# EAGLE schematic arpie_main (EAGLE 5.10)
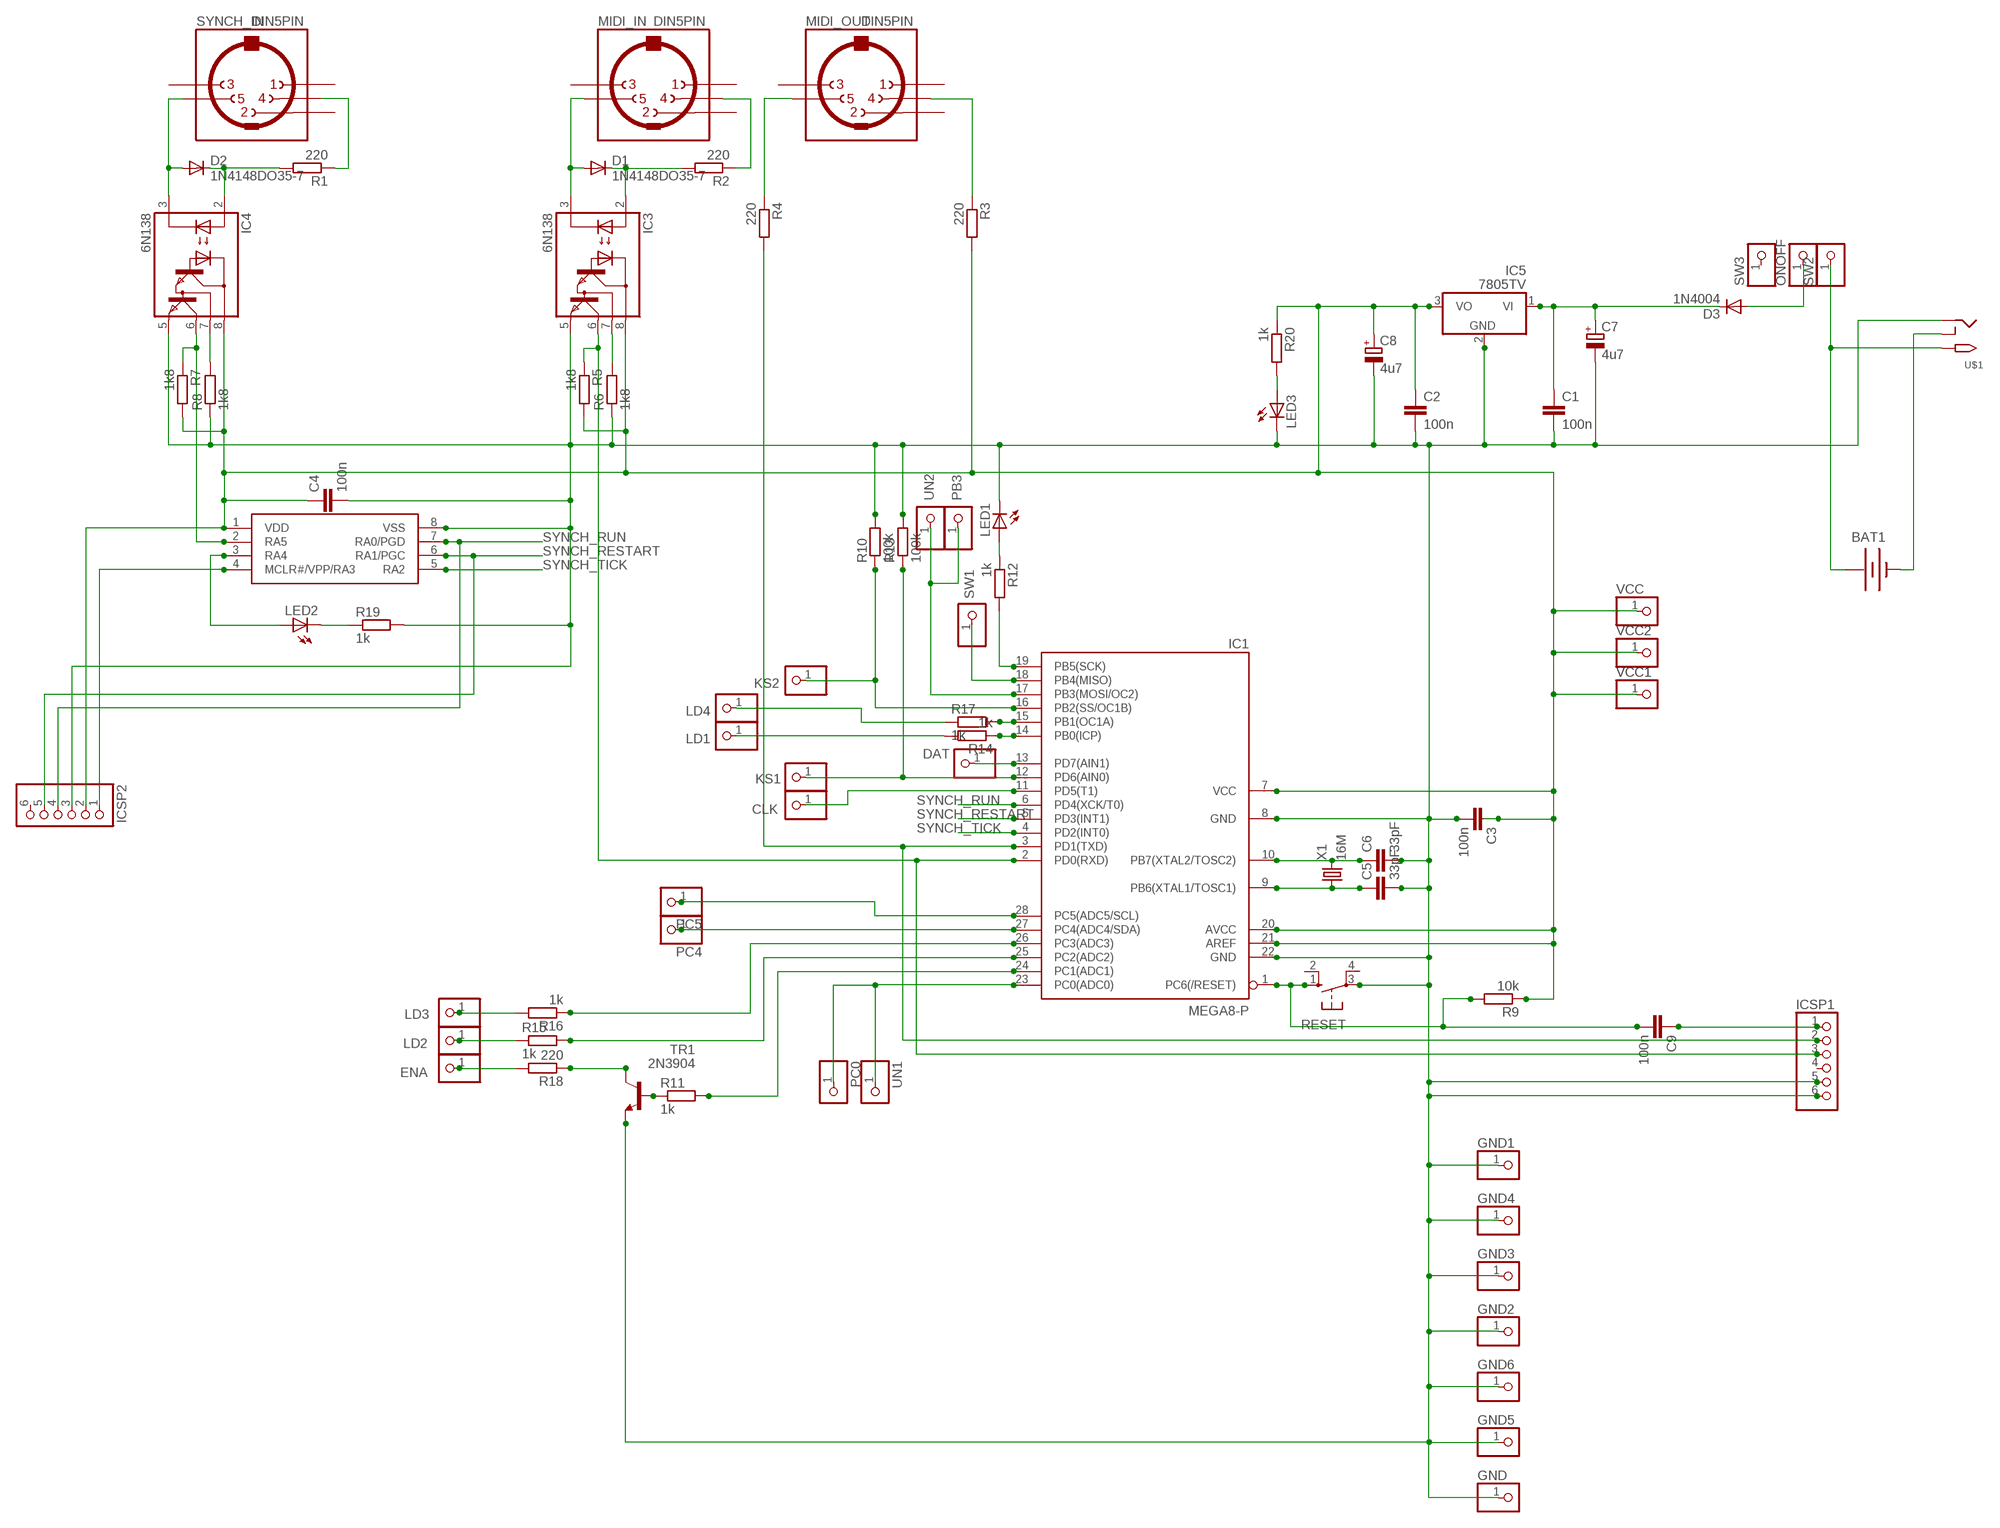
[diagram p0: schematic, sheet 1]

## Parts
BAT1  BATTERY  [PP3_BATTERBOX]
C1  100n  C-EU025-024X044  [C025-024X044]
C2  100n  C-EU025-024X044  [C025-024X044]
C3  100n  C-EU025-024X044  [C025-024X044]
C4  100n  C-EU025-024X044  [C025-024X044]
C5  33pF  C-EU025-024X044  [C025-024X044]
C6  33pF  C-EU025-024X044  [C025-024X044]
C7  4u7  CPOL-EUE2.5-7  [E2,5-7]
C8  4u7  CPOL-EUE2.5-7  [E2,5-7]
C9  100n  C-EU025-024X044  [C025-024X044]
CLK  PINHD-1X1  [1X01]
D1  1N4148DO35-7  [DO35-7]
D2  1N4148DO35-7  [DO35-7]
D3  1N4004  [DO41-10]
DAT  PINHD-1X1  [1X01]
ENA  PINHD-1X1  [1X01]
GND  PINHD-1X1  [1X01]
GND1  PINHD-1X1  [1X01]
GND2  PINHD-1X1  [1X01]
GND3  PINHD-1X1  [1X01]
GND4  PINHD-1X1  [1X01]
GND5  PINHD-1X1  [1X01]
GND6  PINHD-1X1  [1X01]
IC1  MEGA8-P  [DIL28-3]
IC2  PIC12F1822  [DIL08]
IC3  6N138  [DIL08]
IC4  6N138  [DIL08]
IC5  7805TV  [TO220V]
ICSP1  PINHD-1X6  [1X06]
ICSP2  PINHD-1X6  [1X06]
KS1  PINHD-1X1  [1X01]
KS2  PINHD-1X1  [1X01]
LD1  PINHD-1X1  [1X01]
LD2  PINHD-1X1  [1X01]
LD3  PINHD-1X1  [1X01]
LD4  PINHD-1X1  [1X01]
LED1  LED3MM  [LED3MM]
LED2  LED3MM  [LED3MM]
LED3  LED3MM  [LED3MM]
MIDI_IN  DIN5PIN  DIN5PINRAPIDDIN5  [RAPIDDIN5]
MIDI_OUT  DIN5PIN  DIN5PINRAPIDDIN5  [RAPIDDIN5]
ONOFF  PINHD-1X1  [1X01]
PB3  PINHD-1X1  [1X01]
PC0  PINHD-1X1  [1X01]
PC4  PINHD-1X1  [1X01]
PC5  PINHD-1X1  [1X01]
R1  220  R-EU_0207/7  [0207/7]
R2  220  R-EU_0207/7  [0207/7]
R3  220  R-EU_0207/7  [0207/7]
R4  220  R-EU_0207/7  [0207/7]
R5  1k8  R-EU_0207/7  [0207/7]
R6  1k8  R-EU_0207/7  [0207/7]
R7  1k8  R-EU_0207/7  [0207/7]
R8  1k8  R-EU_0207/7  [0207/7]
R9  10k  R-EU_0207/7  [0207/7]
R10  100k  R-EU_0207/7  [0207/7]
R11  1k  R-EU_0207/7  [0207/7]
R12  1k  R-EU_0207/7  [0207/7]
R13  100k  R-EU_0207/2V  [0207/2V]
R14  1k  R-EU_0207/2V  [0207/2V]
R15  1k  R-EU_0207/2V  [0207/2V]
R16  1k  R-EU_0207/2V  [0207/2V]
R17  1k  R-EU_0207/2V  [0207/2V]
R18  220  R-EU_0207/2V  [0207/2V]
R19  1k  R-EU_0207/7  [0207/7]
R20  1k  R-EU_0207/7  [0207/7]
RESET  10-XX  [B3F-10XX]
SW1  PINHD-1X1  [1X01]
SW2  PINHD-1X1  [1X01]
SW3  PINHD-1X1  [1X01]
SYNCH_IN  DIN5PIN  DIN5PINRAPIDDIN5  [RAPIDDIN5]
TR1  2N3904  [TO92]
U$1  2.1MMJACKTHM  [PJ-102A]
UN1  PINHD-1X1  [1X01]
UN2  PINHD-1X1  [1X01]
VCC  PINHD-1X1  [1X01]
VCC1  PINHD-1X1  [1X01]
VCC2  PINHD-1X1  [1X01]
X1  16M  CRYSTALHC49S  [HC49/S]

## Nets
CLK: CLK.1 IC1.11(PD5(T1))
DAT: DAT.1 IC1.13(PD7(AIN1))
ENA: ENA.1 R18.2
GND: C1.2 C2.2 C3.2 C4.2 C5.2 C6.2 C7.- C8.- GND1.1 GND2.1 GND3.1 GND4.1 GND5.1 GND6.1 GND.1 IC1.8(GND) IC1.22(GND) IC2.8(VSS) IC3.5(GND) IC4.5(GND) IC5.2(GND) ICSP1.5 ICSP1.6 ICSP2.3 LED1.K(C) LED3.K(C) R6.1 R8.1 R10.2 R13.2 R19.2 RESET.3(P) TR1.3(E) U$1.RING
KS1: IC1.12(PD6(AIN0)) KS1.1 R13.1
KS2: IC1.16(PB2(SS/OC1B)) KS2.1 R10.1
LD1: LD1.1 R14.2
LD2: LD2.1 R15.1
LD3: LD3.1 R16.2
LD4: LD4.1 R17.1
N$1: D1.A IC3.3(C) MIDI_IN.5
N$2: D1.C IC3.2(A) R2.2
N$3: MIDI_IN.4 R2.1
N$4: D2.A IC4.3(C) SYNCH_IN.5
N$5: D2.C IC4.2(A) R1.2
N$6: R1.1 SYNCH_IN.4
N$7: IC1.2(PD0(RXD)) IC3.6(VO) ICSP1.3 R5.1
N$8: IC3.7(VB) R6.2
N$9: C9.1 ICSP1.1
N$10: IC4.7(VB) R8.2
N$11: MIDI_OUT.5 R4.1
N$12: IC1.3(PD1(TXD)) ICSP1.2 R4.2
N$13: MIDI_OUT.4 R3.1
N$14: R18.1 TR1.1(C)
N$15: IC2.2(RA5) IC4.6(VO) R7.1
N$16: IC2.3(RA4) LED2.A
N$17: IC1.28(PC5(ADC5/SCL)) PC5.1
N$18: IC2.4(MCLR#/VPP/RA3) ICSP2.1
N$19: LED3.A R20.2
N$20: IC1.27(PC4(ADC4/SDA)) PC4.1
N$33: R11.1 TR1.2(B)
N$35: IC1.26(PC3(ADC3)) R16.1
N$36: C6.1 IC1.10(PB7(XTAL2/TOSC2)) X1.2
N$37: C5.1 IC1.9(PB6(XTAL1/TOSC1)) X1.1
N$38: C9.2 IC1.1(PC6(/RESET)) R9.2 RESET.1(S)
N$42: IC1.25(PC2(ADC2)) R15.2
N$43: IC1.24(PC1(ADC1)) R11.2
N$44: IC1.14(PB0(ICP)) R14.1
N$48: IC1.19(PB5(SCK)) R12.2
N$50: LED1.A R12.1
N$52: LED2.K(C) R19.1
N$54: D3.A ONOFF.1
N$55: IC1.15(PB1(OC1A)) R17.2
N$56: BAT1.0V(-) U$1.RING_SW
PWR+: BAT1.9V(+) SW2.1 U$1.TIP
SW1: IC1.18(PB4(MISO)) SW1.1
SYNCH_RESTART: IC1.5(PD3(INT1)) IC2.6(RA1/PGC) ICSP2.5
SYNCH_RUN: IC1.6(PD4(XCK/T0)) IC2.7(RA0/PGD) ICSP2.4
SYNCH_TICK: IC1.4(PD2(INT0)) IC2.5(RA2)
UN1: IC1.23(PC0(ADC0)) PC0.1 UN1.1
UN2: IC1.17(PB3(MOSI/OC2)) PB3.1 UN2.1
VCC: C2.1 C3.1 C4.1 C8.+ IC1.7(VCC) IC1.20(AVCC) IC1.21(AREF) IC2.1(VDD) IC3.8(VCC) IC4.8(VCC) IC5.3(VO) ICSP2.2 R3.2 R5.2 R7.2 R9.1 R20.1 VCC1.1 VCC2.1 VCC.1
VIN: C1.1 C7.+ D3.C IC5.1(VI)
Unconnected: ICSP1.4 ICSP2.6 MIDI_IN.1 MIDI_IN.2 MIDI_IN.3 MIDI_OUT.1 MIDI_OUT.2 MIDI_OUT.3 RESET.2(S1) RESET.4(P1) SW3.1 SYNCH_IN.1 SYNCH_IN.2 SYNCH_IN.3

## Library data of the parts
BAT1 = jasons_stuff:BATTERY: Battery Holders Various common sizes : AA, AAA, 20mm coin cell and 12mm coin cell.
C1-C6 C9 = rcl:C-EU: CAPACITOR, European symbol
C7 C8 = rcl:CPOL-EU: POLARIZED CAPACITOR, European symbol
CLK DAT ENA GND GND1-GND6 KS1 KS2 LD1-LD4 ONOFF PB3 PC0 PC4 PC5 SW1-SW3 UN1 UN2 VCC VCC1 VCC2 = adafruit:PINHD-1X1: Pin header 1x1 for 0.1" spacing With round pins
D1 D2 = diode:1N4148: DIODE high speed (Philips)
D3 = adafruit:1N4004: DIODE General purpose 1N400x type rectifier (With bigger pads) http://www.ladyada.net/library/pcb/eaglelibrary.html
IC1 = atmel:MEGA8-P: MICROCONTROLLER 8 Kbytes FLASH, 1 kbytes SRAM, 512 bytes EEPROM, USART, 4-channel 10 bit ADC, 2-channel 8 bit ADC Pin compatible with Atmega48, ATMega88, ATMega168 Source: avr.lbr
IC2 = jasons_stuff:PIC12F1822
IC3 IC4 = optocoupler:6N138: MOTOROLA OPTO COUPLER
IC5 = linear:78*: Positive VOLTAGE REGULATOR Source: http://cache.national.com/ds/LM/LM78L05.pdf http://www.fairchildsemi.com/ds/LM/LM7805.pdf
ICSP1 ICSP2 = adafruit:PINHD-1X6: PIN HEADER
LED1-LED3 = adafruit:LED: LED OSRAM: - CHIPLED LG R971, LG N971, LY N971, LG Q971, LY Q971, LO R971, LY R971 LH N974, LH R974 LS Q976, LO Q976, LY Q976 LO Q996 - Hyper CHIPLED LW Q18S LB Q993, LB Q99A, LB R99A - SideLED LS A670, LO A670, LY A670, LG A670, LP A670 LB A673, LV A673, LT A673, LW A673 LH A674 LY A675 LS A676, LA A676, LO A676, LY A676, LW A676 LS A679, LY A679, LG A679 - Hyper Micro SIDELED® LS Y876, LA Y876, LO Y876, LY Y876 LT Y87S - SmartLED LW L88C, LW L88S LB L89C, LB L89S, LG L890 LS L89K, LO L89K, LY L89K LS L896, LA L896, LO L896, LY L896 - TOPLED LS T670, LO T670, LY T670, LG T670, LP T670 LSG T670, LSP T670, LSY T670, LOP T670, LYG T670 LG T671, LOG T671, LSG T671 LB T673, LV T673, LT T673, LW T673 LH T674 LS T676, LA T676, LO T676, LY T676, LB T676, LH T676, LSB T676, LW T676 LB T67C, LV T67C, LT T67C, LS T67K, LO T67K, LY T67K, LW E67C LS E67B, LA E67B, LO E67B, LY E67B, LB E67C, LV E67C, LT E67C LW T67C LS T679, LY T679, LG T679 LS T770, LO T770, LY T770, LG T770, LP T770 LB T773, LV T773, LT T773, LW T773 LH T774 LS E675, LA E675, LY E675, LS T675 LS T776, LA T776, LO T776, LY T776, LB T776 LHGB T686 LT T68C, LB T68C - Hyper Mini TOPLED® LB M676 - Mini TOPLED Santana® LG M470 LS M47K, LO M47K, LY M47K Source: http://www.osram.convergy.de/
MIDI_IN MIDI_OUT SYNCH_IN = jasons_stuff:DIN5PIN: Female CONNECTOR 5 pins 90 deg. with shield, horizontal (DIN 41524)
R1-R20 = rcl:R-EU_: RESISTOR, European symbol
RESET = switch-omron:10-XX: OMRON SWITCH
TR1 = transistor:2N3904: NPN TRANSISTOR
U$1 = adafruit:2.1MMJACK: 2.1mm x 5.5mm THM DC jack with internal switch. Digikey part #PJ-102A, 4UCON part #05537 2.1mm x 5.5mm SMT DC jack with internal switch. Digikey part #PJ-002A-SMT, 4UCON part #03267 By microbuilder.eu & adafruit.com
X1 = crystal:CRYSTAL: CRYSTAL